# Altium project Power_Mangement.PrjPcb
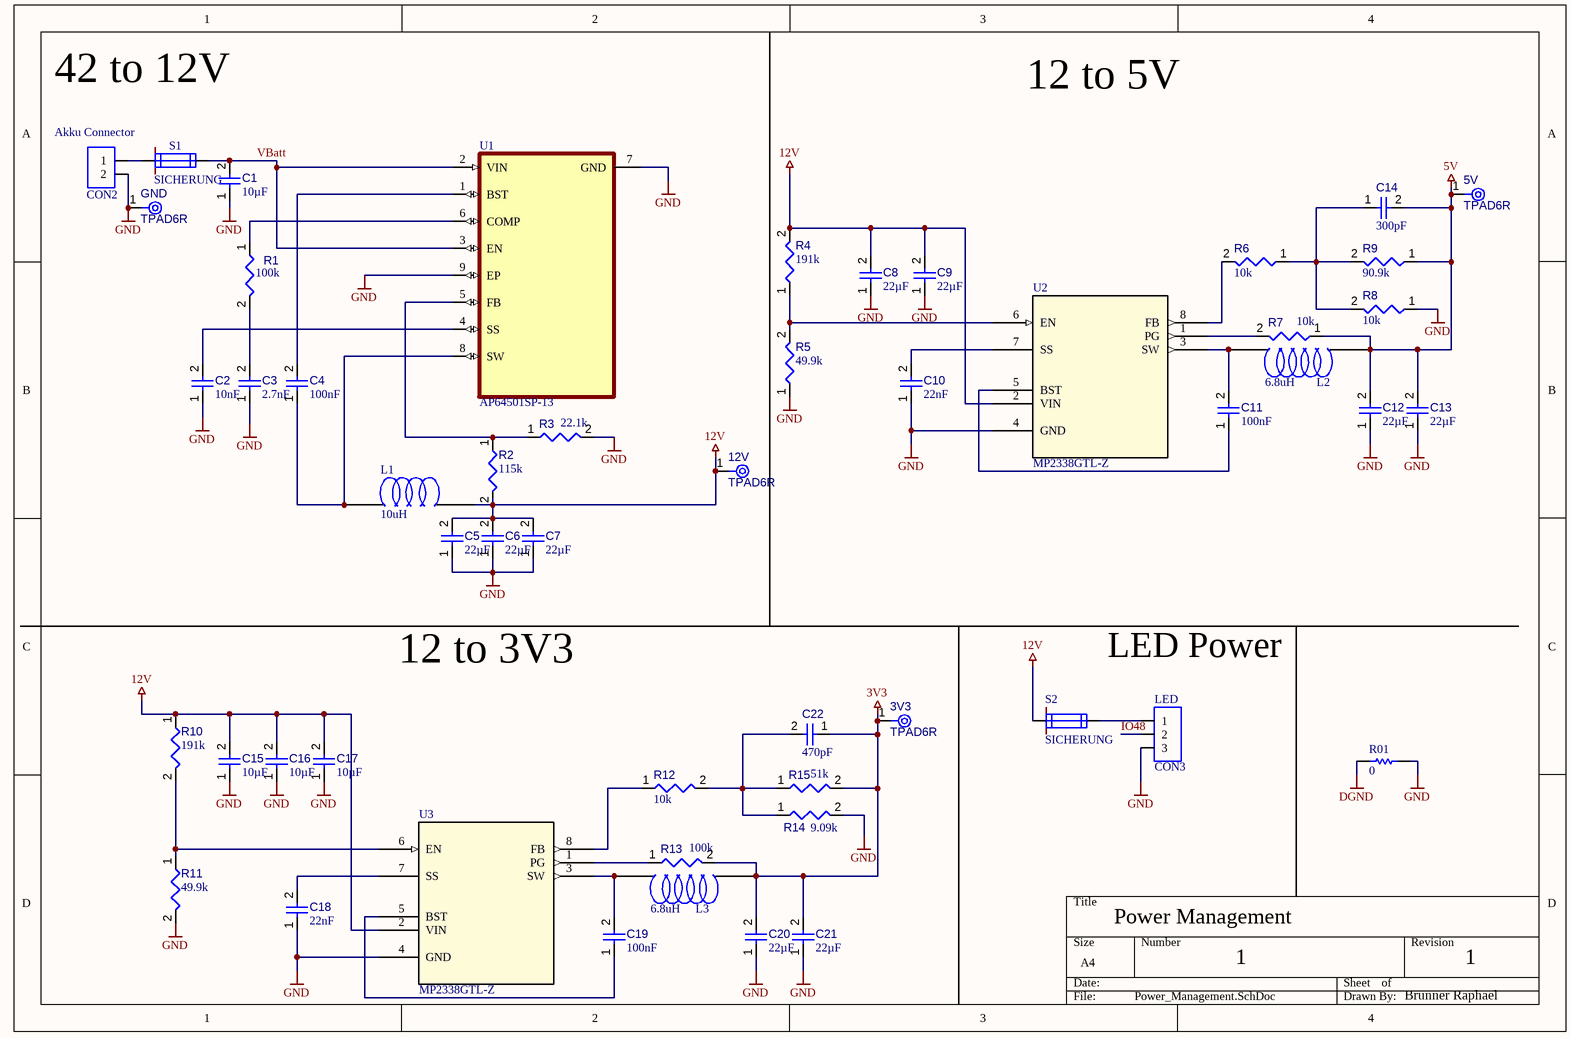
[diagram p0: Power_Management.SchDoc]
4 sheets, 140 parts. Net scope: global (net labels, ports and power ports of the same name join across sheets).
Board file: Power_Managment.PcbDoc
Sheets:
  Power_Management.SchDoc
  Esp32-S3-Mainboard.SchDoc
  Sensors.SchDoc
  Motortreiber.SchDoc

## Sheet Power_Management.SchDoc
size A4; SheetNumber: 1; SheetTotal: 4

### Parts
3V3  TPAD6R  [TP06R]  (no BOM)
5V  TPAD6R  [TP06R]  (no BOM)
12V  TPAD6R  [TP06R]  (no BOM)
Akku_Connector  CON2  [SIP-2]
C1  value 10µF  [CAPC0603(1608)100_L]  (hidden comment: Capacitor 10µF +/-20% 10V 0603)
C2  10nF  [CAPC1608X94X35NL15T15]
C3  2.7nF  [CAPC1608X94X35NL15T15]
C4  value 100nF  [CAPC1608X94X35NL15T15]  (hidden comment: 0.1uF)
C5  value 22µF  [CAPC0805(2012)145_L]  (hidden comment: Capacitor 22µF +/-40% 16V 0805)
C6  value 22µF  [CAPC0805(2012)145_L]  (hidden comment: Capacitor 22µF +/-40% 16V 0805)
C7  value 22µF  [CAPC0805(2012)145_L]  (hidden comment: Capacitor 22µF +/-40% 16V 0805)
C8  value 22µF  [CAPC0805(2012)145_L]  (hidden comment: Capacitor 22µF +/-40% 16V 0805)
C9  value 22µF  [CAPC0805(2012)145_L]  (hidden comment: Capacitor 22µF +/-40% 16V 0805)
C10  value 22nF  [CAPC0402(1005)60_L]  (hidden comment: Capacitor 22nF +/-20% 10V 0402)
C11  value 100nF  [CAPC1608X90X40NL10T20]  (hidden comment: Capacitor 100 nF +/-10% 50 V 0603)
C12  value 22µF  [CAPC0805(2012)145_L]  (hidden comment: Capacitor 22µF +/-40% 16V 0805)
C13  value 22µF  [CAPC0805(2012)145_L]  (hidden comment: Capacitor 22µF +/-40% 16V 0805)
C14  value 300pF  [CAPC1608X90X40NL10T20]  (hidden comment: Capacitor 100 nF +/-10% 50 V 0603)
C15  value 10µF  [CAPC0603(1608)100_L]  (hidden comment: Capacitor 10µF +/-20% 10V 0603)
C16  value 10µF  [CAPC0603(1608)100_L]  (hidden comment: Capacitor 10µF +/-20% 10V 0603)
C17  value 10µF  [CAPC0603(1608)100_L]  (hidden comment: Capacitor 10µF +/-20% 10V 0603)
C18  value 22nF  [CAPC1608X90X40NL10T20]  (hidden comment: Capacitor 100 nF +/-10% 50 V 0603)
C19  value 100nF  [CAPC1608X90X40NL10T20]  (hidden comment: Capacitor 100 nF +/-10% 50 V 0603)
C20  value 22µF  [CAPC0805(2012)145_L]  (hidden comment: Capacitor 22µF +/-40% 16V 0805)
C21  value 22µF  [CAPC0805(2012)145_L]  (hidden comment: Capacitor 22µF +/-40% 16V 0805)
C22  value 470pF  [CAPC1608X90X40NL10T20]  (hidden comment: Capacitor 100 nF +/-10% 50 V 0603)
GND  TPAD6R  [TP06R]  (no BOM)
L1  10uH  [MPL-AY1050]
L2  6.8uH  [MPL-AL6060]
L3  6.8uH  [MPL-AL6060]
LED  CON3  [Sip-3]
R1  value 100k  [RESC1608X55X25ML10T15]  (hidden comment: 34.7k)
R01  value 0  [RESC1608X55X25ML10T15]  (hidden comment: Resistor 0R +/- 5% 0603 100 mW)
R2  115k  [RESC1608X55X25ML10T15]
R3  value 22.1k  [RESC1608X55X25ML10T15]  (hidden comment: 115k)
R4  value 191k  [RESC1608X55X25ML10T15]  (hidden comment: Resistor 100k +/-1% 0603 100 mW)
R5  value 49.9k  [RESC1608X55X25ML10T15]  (hidden comment: Resistor 100k +/-1% 0603 100 mW)
R6  value 10k  [RESC1608X55X25ML10T15]  (hidden comment: Resistor 100k +/-1% 0603 100 mW)
R7  value 10k  [RESC1608X55X25ML10T15]  (hidden comment: Resistor 100k +/-1% 0603 100 mW)
R8  value 10k  [RESC1608X55X25ML10T15]  (hidden comment: Resistor 100k +/-1% 0603 100 mW)
R9  value 90.9k  [RESC1608X55X25ML10T15]  (hidden comment: Resistor 100k +/-1% 0603 100 mW)
R10  value 191k  [RESC1608X55X25ML10T15]  (hidden comment: Resistor 100k +/-1% 0603 100 mW)
R11  value 49.9k  [RESC1608X55X25ML10T15]  (hidden comment: Resistor 100k +/-1% 0603 100 mW)
R12  value 10k  [RESC1608X55X25ML10T15]  (hidden comment: Resistor 100k +/-1% 0603 100 mW)
R13  value 100k  [RESC1608X55X25ML10T15]  (hidden comment: Resistor 100k +/-1% 0603 100 mW)
R14  value 9.09k  [RESC1608X55X25ML10T15]  (hidden comment: Resistor 100k +/-1% 0603 100 mW)
R15  value 51k  [RESC1608X55X25ML10T15]  (hidden comment: Resistor 100k +/-1% 0603 100 mW)
S1  SICHERUNG  [SICHERUNG]
S2  SICHERUNG  [SICHERUNG]
U1  AP64501SP-13  [SOIC127P600X170-9N]
U2  MP2338GTL-Z  [SOT583_MP2338_MNP]
U3  MP2338GTL-Z  [SOT583_MP2338_MNP]

### Nets
3V3: 3V3.1(TP) C20.2 C21.2 C22.1 L3.2 R13.2 R15.2
5V: 5V.1(TP) C12.2 C13.2 C14.2 L2.2 R7.1 R9.1
12V: 12V.1(TP) C5.2 C6.2 C7.2 C8.2 C9.2 C15.2 C16.2 C17.2 L1.2 R2.2 R4.2 R10.1 S2.1 U2.2(VIN) U3.2(VIN)
DGND: R01.1
GND: Akku_Connector.2 C1.1 C2.1 C3.1 C5.1 C6.1 C7.1 C8.1 C9.1 C10.1 C12.1 C13.1 C15.1 C16.1 C17.1 C18.1 C20.1 C21.1 GND.1(TP) LED.3 R01.2 R3.2 R5.1 R8.1 R11.2 R14.2 U1.7(GND) U1.9(EP) U2.4(GND) U3.4(GND)  [project net ALS]
IO48: LED.2
VBatt: C1.2 S1.2 U1.2(VIN) U1.3(EN)
NetAkku_Connector_1: Akku_Connector.1 S1.1
NetC2_2: C2.2 U1.4(SS)
NetC3_2: C3.2 R1.2
NetC4_1: C4.1 L1.1 U1.8(SW)
NetC4_2: C4.2 U1.1(BST)
NetC10_2: C10.2 U2.7(SS)
NetC11_1: C11.1 U2.5(BST)
NetC11_2: C11.2 L2.1 U2.3(SW)
NetC14_1: C14.1 R6.1 R8.2 R9.2
NetC18_2: C18.2 U3.7(SS)
NetC19_1: C19.1 U3.5(BST)
NetC19_2: C19.2 L3.1 U3.3(SW)
NetC22_2: C22.2 R12.2 R14.1 R15.1
NetLED_1: LED.1 S2.2
NetR1_1: R1.1 U1.6(COMP)
NetR2_1: R2.1 R3.1 U1.5(FB)
NetR4_1: R4.1 R5.2 U2.6(EN)
NetR6_2: R6.2 U2.8(FB)
NetR7_2: R7.2 U2.1(PG)
NetR10_2: R10.2 R11.1 U3.6(EN)
NetR12_1: R12.1 U3.8(FB)
NetR13_1: R13.1 U3.1(PG)

### Notes on the sheet
- 42 to 12V
- 12 to 5V
- 12 to 3V3
- LED Power
- Power Management
- 1
- Brunner Raphael

### Library data of the parts
3V3 5V 12V GND = CMP-00028-00002-2: 0.6mm round; Pins: 1
Akku_Connector = CON2: Stecker
C1 C15-C17 = CMP-001-00075-4: Chip Capacitor, 10µF +/-20%, 10V, 0603, Thickness 1 mm; Tolerance: 10%; Voltage Rating: 10V; Max Operating Temperature: 85°C; Pins: 2; Case/Package: 0603; Mounting Technology: SMT; Min Operating Temperature: -55°C
C2-C4 = CMP-001-00003-6: Chip Capacitor, 1 uF, +/- 10%, 16 V, 0603 (1608 Metric); Voltage Rating: 16V; Capacitor Type: Ceramic; Max Operating Temperature: 125°C; Pins: 2; Tolerance: 10%; Min Operating Temperature: -55°C; RoHS Compliant: True; Mounting Technology: SM; Case/Package: 0603
  C2: Value: 10nF
  C3: Value: 2.7nF
C5-C9 C12 C13 C20 C21 = CMP-001-00081-4: Chip Capacitor, 22µF +/-40%, 16V, 0805, Thickness 1.45 mm; Tolerance: 5%; Voltage Rating: 16V; Mounting Technology: SMT; Pins: 2; Max Operating Temperature: 85°C; Case/Package: 0805; Min Operating Temperature: -55°C
C10 = CMP-001-00062-3: Chip Capacitor, 22nF +/-20%, 10V, 0402, Thickness 0.6 mm; Tolerance: 10%; Min Operating Temperature: -55°C; Case/Package: 0402; Pins: 2; Max Operating Temperature: 85°C; Mounting Technology: SMT; Voltage Rating: 10V
C11 C14 C18 C19 C22 = CMP-001-00017-6: Chip Capacitor, 100 nF, +/- 10%, 50 V, 0603 (1608 Metric); Voltage Rating: 50V; Capacitor Type: Ceramic; Tolerance: 10%; Mounting Technology: SM; Max Operating Temperature: 125°C; RoHS Compliant: True; Pins: 2; Case/Package: 0603; Min Operating Temperature: -55°C
L1-L3 = Component_1
LED = CON3: Stecker
R1-R15 = CMP-009-00023-5: Chip Resistor, 100 KOhm, +/- 1%, 0.1 W, -55 to 155 degC, 0603 (1608 Metric); Voltage Rating: 50V; Power: 100mW; Max Operating Temperature: 155°C; RoHS Compliant: True; Tolerance: 1%; Pins: 2; Case/Package: 0603; Mounting Technology: SM; Min Operating Temperature: -55°C
  R2: Value: 115k
R01 = CMP-009-00006-5: Chip Resistor, 0 Ohm, 0.1 W, -55 to 155 degC, 0603 (1608 Metric); Power: 100mW; Voltage Rating: 50V; Max Operating Temperature: 155°C; RoHS Compliant: True; Mounting Technology: SM; Case/Package: 0603; Min Operating Temperature: -55°C; Tolerance: 5%; Pins: 2
S1 S2 = SICHERUNG: Text Field1: Strom
U1 = AP64501SP-13: MF: {'manufacturer': u'Diodes Incorporated'}; Package: None; Price: None; Value: *; MP: AP64501SP-13; Availability: Unavailable
U2 U3 = MP2338GTL-Z: High-Efficiency 28V 3A 450kHz Synchronous Step-Down Converter In SOT583 Package; Manufacturer_Name: Monolithic Power Systems; Copyright: Copyright (C) 2025 Ultra Librarian. All rights reserved.; Manufacturer_Part_Number: MP2338GTL-Z; Datasheet: https://www.monolithicpower.com/en/documentview/productdocument/index/version/2/document_type/Datasheet/lang/en/sku/MP2338GTL; RefDes: RefDes; Type: Type

## Sheet Esp32-S3-Mainboard.SchDoc
size A4; SheetNumber: 2; SheetTotal: 4
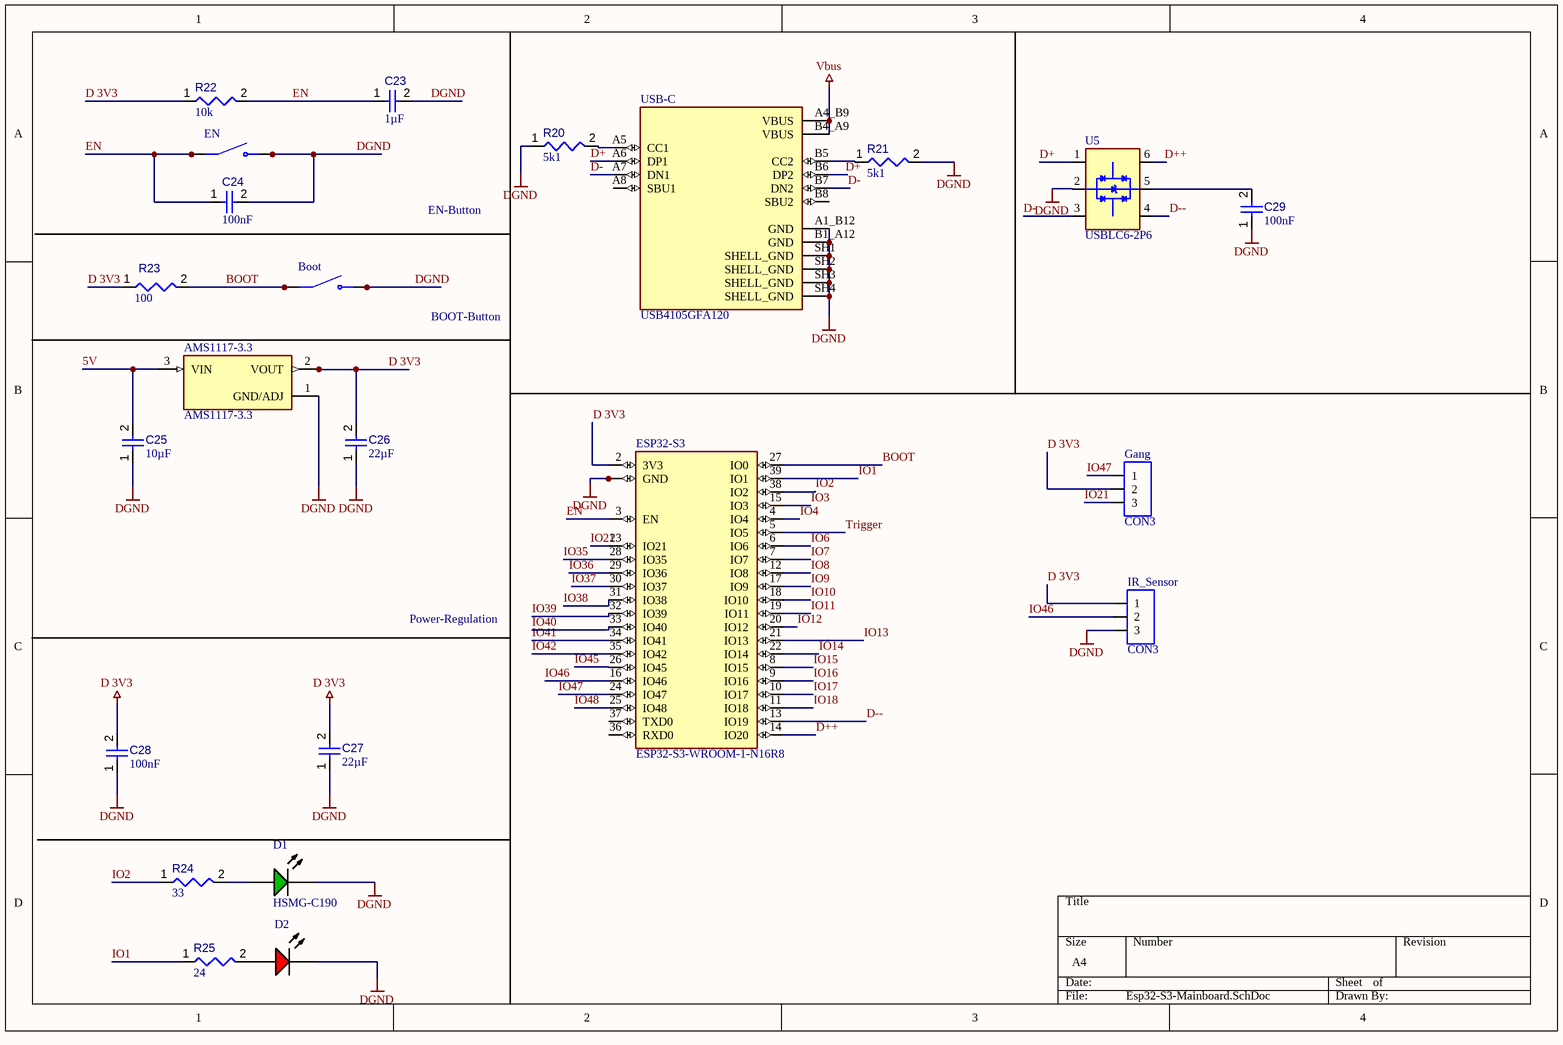
[diagram p1: Esp32-S3-Mainboard.SchDoc]

### Parts
AMS1117-3.3  AMS1117-3.3  [SOT229P700X180-4N]
Boot  FSM2JSMLTR  [SW_1571527-2]  (value not drawn)
C23  value 1µF  [CAPC1608X90X35ML15T15]  (hidden comment: Capacitor 1uF +/- 10% 16V 0603)
C24  value 100nF  [CAPC1608X90X40NL10T20]  (hidden comment: Capacitor 100 nF +/-10% 50 V 0603)
C25  value 10µF  [CAPC0603(1608)100_L]  (hidden comment: Capacitor 10µF +/-20% 10V 0603)
C26  value 22µF  [CAPC0805(2012)145_L]  (hidden comment: Capacitor 22µF +/-40% 16V 0805)
C27  value 22µF  [CAPC0805(2012)145_L]  (hidden comment: Capacitor 22µF +/-40% 16V 0805)
C28  value 100nF  [CAPC1608X90X40NL10T20]  (hidden comment: Capacitor 100 nF +/-10% 50 V 0603)
C29  value 100nF  [CAPC0402(1005)60_L]  (hidden comment: Capacitor 100nF +/-20% 50V 0402)
D1  HSMG-C190  [AVAG-HSMX-C190_V]
D2  19-217/R6C-AL1M2VY/3T  [EVRL-0603-2_V]  (value not drawn)
EN  FSM2JSMLTR  [SW_1571527-2]  (value not drawn)
ESP32-S3  ESP32-S3-WROOM-1-N16R8  [ESP32S3WROOM1N8R2]
Gang  CON3  [Sip-3]
IR_Sensor  CON3  [Sip-3]
R20  value 5k1  [RESC1608X55X25ML10T15]  (hidden comment: Resistor 100k +/-1% 0603 100 mW)
R21  value 5k1  [RESC1608X55X25ML10T15]  (hidden comment: Resistor 100k +/-1% 0603 100 mW)
R22  value 10k  [RESC1608X55X25ML10T15]  (hidden comment: Resistor 10k +/-1% 0603 100 mW)
R23  value 100  [RESC1608X55X25ML10T15]  (hidden comment: Resistor 10k +/-1% 0603 100 mW)
R24  value 33  [RESC1608X55X25ML10T15]  (hidden comment: Resistor 10k +/-1% 0603 100 mW)
R25  value 24  [RESC1608X55X25ML10T15]  (hidden comment: Resistor 10k +/-1% 0603 100 mW)
U5  USBLC6-2P6  [SOT50P160X60-6N]
USB-C  USB4105GFA120  [GCT_USB4105GFA120]

### Nets
5V: AMS1117-3.3.3(VIN) C25.2
D 3V3: AMS1117-3.3.2(VOUT) C26.2 C27.2 C28.2 ESP32-S3.2(3V3) Gang.2 IR_Sensor.1 R22.1 R23.1
DGND: AMS1117-3.3.1(GND/ADJ) Boot.3(NO) Boot.4(NO) C23.2 C24.2 C25.1 C26.1 C27.1 C28.1 C29.1 D1.2(K) D2.2(K) EN.3(NO) EN.4(NO) ESP32-S3.1(GND) ESP32-S3.40(GND) ESP32-S3.41(GND) ESP32-S3.42(GND) ESP32-S3.43(GND) ESP32-S3.44(GND) ESP32-S3.45(GND) ESP32-S3.46(GND) ESP32-S3.47(GND) ESP32-S3.48(GND) ESP32-S3.49(GND) IR_Sensor.3 R20.1 R21.2 U5.2(GND) USB-C.A1_B12(GND) USB-C.B1_A12(GND) USB-C.SH1(SHELL_GND) USB-C.SH2(SHELL_GND) USB-C.SH3(SHELL_GND) USB-C.SH4(SHELL_GND)
Vbus: USB-C.A4_B9(VBUS) USB-C.B4_A9(VBUS)
BOOT: Boot.1(COM) Boot.2(COM) ESP32-S3.27(IO0) R23.2
D+: U5.1(I/O1_1) USB-C.A6(DP1) USB-C.B6(DP2)
D++: ESP32-S3.14(IO20) U5.6(I/O1_2)
D-: U5.3(I/O2_1) USB-C.A7(DN1) USB-C.B7(DN2)
D--: ESP32-S3.13(IO19) U5.4(I/O2_2)
EN: C23.1 C24.1 EN.1(COM) EN.2(COM) ESP32-S3.3(EN) R22.2
IO1: ESP32-S3.39(IO1) R25.1
IO2: ESP32-S3.38(IO2) R24.1
IO3: ESP32-S3.15(IO3)
IO4: ESP32-S3.4(IO4)
IO6: ESP32-S3.6(IO6)
IO7: ESP32-S3.7(IO7)
IO8: ESP32-S3.12(IO8)
IO9: ESP32-S3.17(IO9)
IO10: ESP32-S3.18(IO10)
IO11: ESP32-S3.19(IO11)
IO12: ESP32-S3.20(IO12)
IO13: ESP32-S3.21(IO13)
IO14: ESP32-S3.22(IO14)
IO15: ESP32-S3.8(IO15)
IO16: ESP32-S3.9(IO16)
IO17: ESP32-S3.10(IO17)
IO18: ESP32-S3.11(IO18)
IO21: ESP32-S3.23(IO21) Gang.3
IO35: ESP32-S3.28(IO35)
IO36: ESP32-S3.29(IO36)
IO37: ESP32-S3.30(IO37)
IO38: ESP32-S3.31(IO38)
IO39: ESP32-S3.32(IO39)
IO40: ESP32-S3.33(IO40)
IO41: ESP32-S3.34(IO41)
IO42: ESP32-S3.35(IO42)
IO45: ESP32-S3.26(IO45)
IO46: ESP32-S3.16(IO46) IR_Sensor.2
IO47: ESP32-S3.24(IO47) Gang.1
IO48: ESP32-S3.25(IO48)
Trigger: ESP32-S3.5(IO5)
NetC29_2: C29.2 U5.5(VBUS)
NetD1_1: D1.1(A) R24.2
NetD2_1: D2.1(A) R25.2
NetR20_2: R20.2 USB-C.A5(CC1)
NetR21_1: R21.1 USB-C.B5(CC2)

Not connected (* = marked no-connect by the designer): ESP32-S3 36(RXD0) 37(TXD0); USB-C A8(SBU1) B8(SBU2)

### Notes on the sheet
- EN-Button
- BOOT-Button
- Power-Regulation

### Library data of the parts
AMS1117-3.3 = AMS1117-3.3: LDO Voltage Regulators 800MA LDO LINEAR REG; MF: ams AG; SnapEDA_Link: https://www.snapeda.com/parts/AMS1117-3.3/ams/view-part/?ref=snap; Package: SOT-223 Seeed Technology; Value: *; MP: AMS1117-3.3; Check_prices: https://www.snapeda.com/parts/AMS1117-3.3/ams/view-part/?ref=eda
Boot EN = CMP-016-000000-1: Switch Tactile OFF (ON) SPST Round Button Gull Wing 0.05A 24VDC 0.98N SMD T/R; MF: TE Connectivity; SnapEDA_Link: https://www.snapeda.com/parts/FSM2JSMLTR/TE+Connectivity+ALCOSWITCH+Switches/view-part/?ref=snap; Package: None; Check_prices: https://www.snapeda.com/parts/FSM2JSMLTR/TE+Connectivity+ALCOSWITCH+Switches/view-part/?ref=eda; Design Item ID: FSM2JSMLTR; Source: FSM2JSMLTR.SchLib; Value: *; MP: FSM2JSMLTR
C23 = CMP-001-00004-6: Chip Capacitor, 1 uF, +/- 10%, 16 V, 0603 (1608 Metric); Capacitor Type: Ceramic; Mounting Technology: SM; RoHS Compliant: True; Min Operating Temperature: -55°C; Case/Package: 0603; Pins: 2; Voltage Rating: 16V; Max Operating Temperature: 125°C; Tolerance: 10%
C24 C28 = CMP-001-00017-6: as C11 on sheet Power_Management; Tolerance: 10%; Mounting Technology: SM; Max Operating Temperature: 125°C; RoHS Compliant: True; Pins: 2; Case/Package: 0603; Min Operating Temperature: -55°C
C25 = CMP-001-00075-4: as C1 on sheet Power_Management; Voltage Rating: 10V; Max Operating Temperature: 85°C; Pins: 2; Case/Package: 0603; Mounting Technology: SMT; Min Operating Temperature: -55°C
C26 C27 = CMP-001-00081-4: as C5 on sheet Power_Management; Voltage Rating: 16V; Mounting Technology: SMT; Pins: 2; Max Operating Temperature: 85°C; Case/Package: 0805; Min Operating Temperature: -55°C
C29 = CMP-001-00067-3: Chip Capacitor, 100nF +/-20%, 50V, 0402, Thickness 0.6 mm; Tolerance: 10%; Min Operating Temperature: -55°C; Pins: 2; Case/Package: 0402; Max Operating Temperature: 85°C; Voltage Rating: 50V; Mounting Technology: SMT
D1 = CMP-007-00013-2: LED Uni-Color Green, 52 mW, 20 mA, -40 to 85 degC, 2-Pin SMD, RoHS, Tape and Reel; Manufacturer: Avago; Forward Current: 20mA; Viewing Angle: 170degrees; Luminous Intensity: 15mcd; Lens Style: Diffused; Forward Voltage: 2.2V; Power: 52mW; Mounting Technology: SM; RoHS Compliant: True; Packaging: TapeandReel; Illumination Colour: Green; Datasheet URL: http://docs.avagotech.com/docs/AV02-0551EN; Min Operating Temperature: -40°C; Max Operating Temperature: 85°C; Pins: 2; Package Description: 2-Pin Surface Mount Device, Body 1.6 x 0.8 mm, Height 0.9 mm; Nominal Vf: 2.2V; Case/Package: 0603; Manufacturer URL: http://www.avagotech.com/; Datasheet Version: Mar-12; Colour: Green; Package Reference: HSMX-C190; Package Quantity: 4000
D2 = CMP-007-00004-2: Chip LED, Red, 5 V, 25 mA, -40 to 85 degC, 2-Pin SMD (0603), RoHS, Tape and Reel; Manufacturer: Everlight Electronics; Forward Voltage: 2.2V; Lens Style: Clear; Package Reference: 0603; Datasheet Version: Rev. 1, 01/2005; Mounting Technology: SM; RoHS Compliant: False; Datasheet URL: https://datasheet.ciiva.com/4688/el-19-217-r6c-al1m2vy-3tpdf-187026-4688713.pdf; Case/Package: 0603; Colour: Red; Manufacturer URL: http://www.everlight.com/; Package Description: 2-Pin Surface Mount Device, Body 1.6 x 0.8 mm
ESP32-S3 = ESP32-S3-WROOM-1-N16R8: Bluetooth, WiFi 802.11b/g/n, Bluetooth v5.0 Transceiver Module 2.4GHz PCB Trace Surface Mount; MF: Espressif Systems; SnapEDA_Link: https://www.snapeda.com/parts/ESP32-S3-WROOM-1-N16R8/Espressif+Systems/view-part/?ref=snap; Package: NON STANDARD Espressif Systems; Value: *; MP: ESP32-S3-WROOM-1-N16R8; Check_prices: https://www.snapeda.com/parts/ESP32-S3-WROOM-1-N16R8/Espressif+Systems/view-part/?ref=eda
Gang IR_Sensor = CON3: Stecker
R20 R21 = CMP-009-00023-5: as R1 on sheet Power_Management; Max Operating Temperature: 155°C; RoHS Compliant: True; Tolerance: 1%; Pins: 2; Case/Package: 0603; Mounting Technology: SM; Min Operating Temperature: -55°C
R22-R25 = CMP-009-00017-5: Chip Resistor, 10 KOhm, +/- 1%, 01 W, -55 to 155 degC, 0603 (1608 Metric); Voltage Rating: 50V; Power: 100mW; RoHS Compliant: True; Min Operating Temperature: -55°C; Pins: 2; Case/Package: 0603; Mounting Technology: SM; Max Operating Temperature: 155°C; Tolerance: 1%
U5 = USBLC6-2P6: 17V Clamp 5A (8/20Âµs) Ipp Tvs Diode Surface Mount SOT-666; MF: STMicroelectronics; SnapEDA_Link: https://www.snapeda.com/parts/USBLC6-2P6/STMicroelectronics/view-part/?ref=snap; Package: SOT-666 STMicroelectronics; Value: *; MP: USBLC6-2P6; Check_prices: https://www.snapeda.com/parts/USBLC6-2P6/STMicroelectronics/view-part/?ref=eda
USB-C = USB4105GFA120: USB CONN, 2.0 TYPE C, RCPT, 16POS, SMT; USB Connector Type:USB Type C; USB Standard:USB 2.0; Gender:Receptacle; No. of Positions:16Positions; Connector Mounting:Surface Mount, Through Hole Mount; Orientation:Right Angle RoHS Compliant: Yes; MF: Global Connector Technology; SnapEDA_Link: https://www.snapeda.com/parts/USB4105GFA120/Global+Connector+Technology/view-part/?ref=snap; Package: None; Value: *; MP: USB4105GFA120; Check_prices: https://www.snapeda.com/parts/USB4105GFA120/Global+Connector+Technology/view-part/?ref=eda

## Sheet Sensors.SchDoc
size A4; SheetNumber: 3; SheetTotal: 4
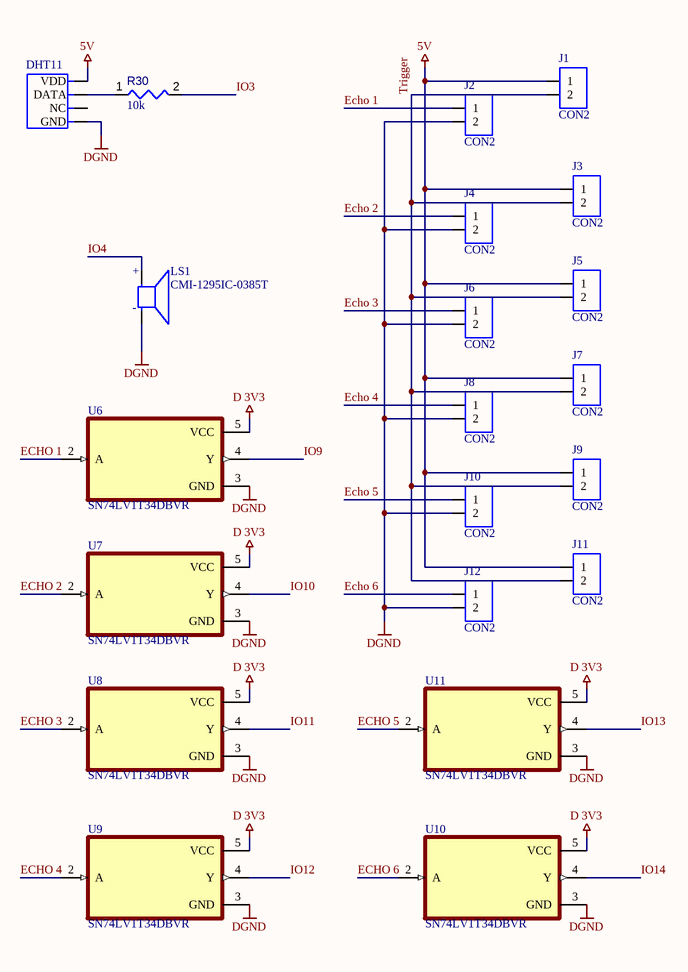
[diagram p2: Sensors.SchDoc]

### Parts
(Parts that share a designator on the sheet are numbered #1, #2 ... from top to bottom, then left to right.)
DHT11  TEM-HUM-DHT11(4P-15.5X12.0MM)  [SNR4-2.54-15.5X12.0X5.5MM]  (value not drawn)
J1  CON2  [SIP-2]
J2  CON2  [SIP-2]
J3  CON2  [SIP-2]
J4  CON2  [SIP-2]
J5  CON2  [SIP-2]
J6  CON2  [SIP-2]
J7  CON2  [SIP-2]
J8  CON2  [SIP-2]
J9  CON2  [SIP-2]
J10  CON2  [SIP-2]
J11  CON2  [SIP-2]
J12  CON2  [SIP-2]
LS1  CMI-1295IC-0385T  [CUI_CMI-1295IC-0385T]
R30  value 10k  [RESC1608X55X25ML10T15]  (hidden comment: Resistor 10k +/-1% 0603 100 mW)
U6#1  SN74LV1T34DBVR  [SOT95P280X145-5N]
U7#1  SN74LV1T34DBVR  [SOT95P280X145-5N]
U8  SN74LV1T34DBVR  [SOT95P280X145-5N]
U9  SN74LV1T34DBVR  [SOT95P280X145-5N]
U10  SN74LV1T34DBVR  [SOT95P280X145-5N]
U11  SN74LV1T34DBVR  [SOT95P280X145-5N]

### Nets
5V: DHT11.1(VDD) J1.1 J3.1 J5.1 J7.1 J9.1 J11.1
D 3V3: U6#1.5(VCC) U7#1.5(VCC) U8.5(VCC) U9.5(VCC) U10.5(VCC) U11.5(VCC)
DGND: DHT11.4(GND) J2.2 J4.2 J6.2 J8.2 J10.2 J12.2 LS1.N U6#1.3(GND) U7#1.3(GND) U8.3(GND) U9.3(GND) U10.3(GND) U11.3(GND)
Echo 1: J2.1 U6#1.2(A)
Echo 2: J4.1 U7#1.2(A)
Echo 3: J6.1 U8.2(A)
Echo 4: J8.1 U9.2(A)
Echo 5: J10.1 U11.2(A)
Echo 6: J12.1 U10.2(A)
IO3: R30.2
IO4: LS1.P
IO9: U6#1.4(Y)
IO10: U7#1.4(Y)
IO11: U8.4(Y)
IO12: U9.4(Y)
IO13: U11.4(Y)
IO14: U10.4(Y)
Trigger: J1.2 J3.2 J5.2 J7.2 J9.2 J11.2
NetDHT11_2: DHT11.2(DATA) R30.1

Not connected (* = marked no-connect by the designer): DHT11 3(NC)

### Notes on the sheet
- (in symbol CMI-1295IC-0385T) +; -

### Library data of the parts
DHT11 = TEM-HUM-DHT11(4P-15.5X12.0MM): Äá»™ áº©m, nhiá»‡t Ä‘á»™ Ká»¹ thuáº­t sá»‘ Â±5% RH qua lá»—; MF: UNIVERSAL-SOLDER Electronics Ltd; MP: DHT11; SnapEDA_Link: https://www.snapeda.com/parts/DHT11/UNIVERSAL-SOLDER+Electronics+Ltd/view-part/?ref=snap; Package: None; Value: *; Check_prices: https://www.snapeda.com/parts/DHT11/UNIVERSAL-SOLDER+Electronics+Ltd/view-part/?ref=eda
J1-J12 = CON2: Stecker
LS1 = CMI-1295IC-0385T: 12 mm, 3 Vdc, 85 dB, Through Hole, Driving Circuit, Magnetic Audio Indicator Buzzer; MF: Same Sky; SnapEDA_Link: https://www.snapeda.com/parts/CMI-1295IC-0385T/Same+Sky/view-part/?ref=snap; Package: Package; Value: *; MP: CMI-1295IC-0385T; Check_prices: https://www.snapeda.com/parts/CMI-1295IC-0385T/Same+Sky/view-part/?ref=eda
R30 = CMP-009-00017-5: as R22 on sheet Esp32-S3-Mainboard; RoHS Compliant: True; Min Operating Temperature: -55°C; Pins: 2; Case/Package: 0603; Mounting Technology: SM; Max Operating Temperature: 155°C; Tolerance: 1%
U6#1 U7#1 U8-U11 = SN74LV1T34DBVR: Single Power Supply BUFFER Logic Level Shifter (no enable); MF: Texas Instruments; SnapEDA_Link: https://www.snapeda.com/parts/SN74LV1T34DBVR/Texas+Instruments/view-part/?ref=snap; Package: SOT-23-5 Texas Instruments; Value: *; MP: SN74LV1T34DBVR; Check_prices: https://www.snapeda.com/parts/SN74LV1T34DBVR/Texas+Instruments/view-part/?ref=eda

## Sheet Motortreiber.SchDoc
size A4; SheetNumber: 4; SheetTotal: 4
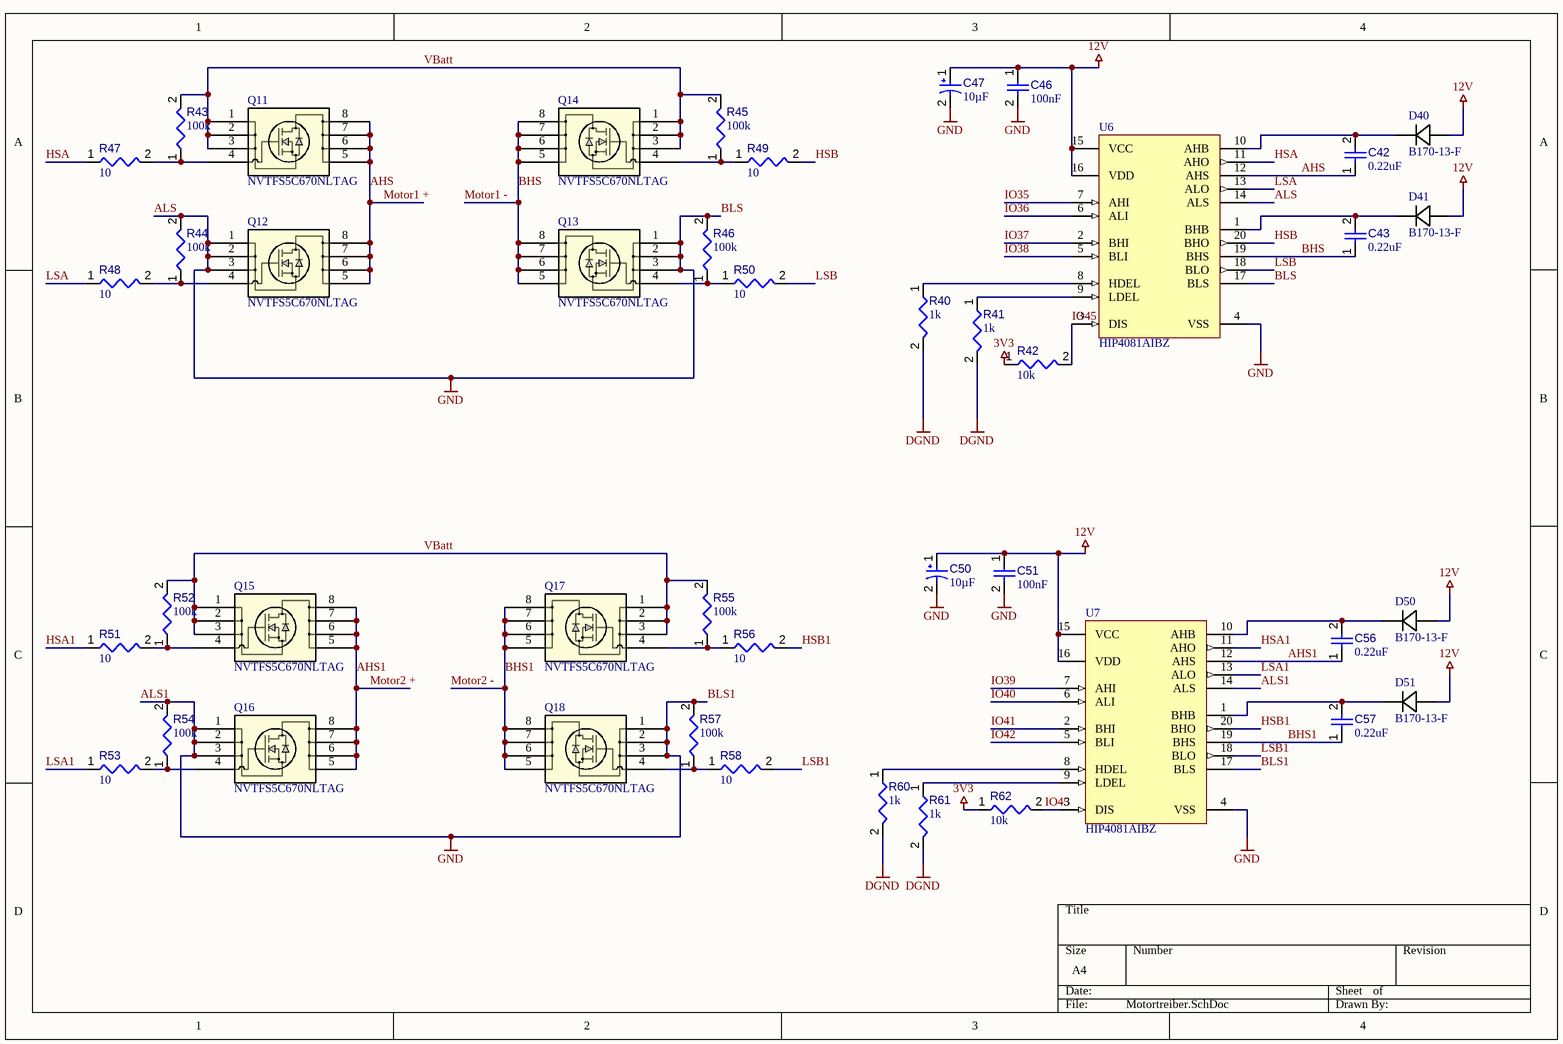
[diagram p3: Motortreiber.SchDoc]

### Parts
(Parts that share a designator on the sheet are numbered #1, #2 ... from top to bottom, then left to right.)
C42  value 0.22uF  [CAPC1608X90X40NL10T20]  (hidden comment: Capacitor 100 nF +/-10% 50 V 0603)
C43  value 0.22uF  [CAPC1608X90X40NL10T20]  (hidden comment: Capacitor 100 nF +/-10% 50 V 0603)
C46  value 100nF  [CAPC1608X90X40NL10T20]  (hidden comment: Capacitor 100 nF +/-10% 50 V 0603)
C47  value 10µF  [CAPPR55-200-1100X500X1200]  (hidden comment: ECA1HM100)
C50  value 10µF  [CAPPR55-200-1100X500X1200]  (hidden comment: ECA1HM100)
C51  value 100nF  [CAPC1608X90X40NL10T20]  (hidden comment: Capacitor 100 nF +/-10% 50 V 0603)
C56  value 0.22uF  [CAPC1608X90X40NL10T20]  (hidden comment: Capacitor 100 nF +/-10% 50 V 0603)
C57  value 0.22uF  [CAPC1608X90X40NL10T20]  (hidden comment: Capacitor 100 nF +/-10% 50 V 0603)
D40  B170-13-F  [SMA_DIO]
D41  B170-13-F  [SMA_DIO]
D50  B170-13-F  [SMA_DIO]
D51  B170-13-F  [SMA_DIO]
Q11  NVTFS5C670NLTAG  [WDFN8_511AB_ONS]
Q12  NVTFS5C670NLTAG  [WDFN8_511AB_ONS]
Q13  NVTFS5C670NLTAG  [WDFN8_511AB_ONS]
Q14  NVTFS5C670NLTAG  [WDFN8_511AB_ONS]
Q15  NVTFS5C670NLTAG  [WDFN8_511AB_ONS]
Q16  NVTFS5C670NLTAG  [WDFN8_511AB_ONS]
Q17  NVTFS5C670NLTAG  [WDFN8_511AB_ONS]
Q18  NVTFS5C670NLTAG  [WDFN8_511AB_ONS]
R40  value 1k  [RESC1608X55X25ML10T15]  (hidden comment: Resistor 1k +/-1% 0603 100 mW)
R41  value 1k  [RESC1608X55X25ML10T15]  (hidden comment: Resistor 1k +/-1% 0603 100 mW)
R42  value 10k  [RESC1608X55X25ML10T15]  (hidden comment: Resistor 10k +/-1% 0603 100 mW)
R43  value 100k  [RESC1608X55X25ML10T15]  (hidden comment: Resistor 100k +/-1% 0603 100 mW)
R44  value 100k  [RESC1608X55X25ML10T15]  (hidden comment: Resistor 100k +/-1% 0603 100 mW)
R45  value 100k  [RESC1608X55X25ML10T15]  (hidden comment: Resistor 100k +/-1% 0603 100 mW)
R46  value 100k  [RESC1608X55X25ML10T15]  (hidden comment: Resistor 100k +/-1% 0603 100 mW)
R47  value 10  [RESC1608X55X25ML10T15]  (hidden comment: Resistor 100k +/-1% 0603 100 mW)
R48  value 10  [RESC1608X55X25ML10T15]  (hidden comment: Resistor 100k +/-1% 0603 100 mW)
R49  value 10  [RESC1608X55X25ML10T15]  (hidden comment: Resistor 100k +/-1% 0603 100 mW)
R50  value 10  [RESC1608X55X25ML10T15]  (hidden comment: Resistor 100k +/-1% 0603 100 mW)
R51  value 10  [RESC1608X55X25ML10T15]  (hidden comment: Resistor 100k +/-1% 0603 100 mW)
R52  value 100k  [RESC1608X55X25ML10T15]  (hidden comment: Resistor 100k +/-1% 0603 100 mW)
R53  value 10  [RESC1608X55X25ML10T15]  (hidden comment: Resistor 100k +/-1% 0603 100 mW)
R54  value 100k  [RESC1608X55X25ML10T15]  (hidden comment: Resistor 100k +/-1% 0603 100 mW)
R55  value 100k  [RESC1608X55X25ML10T15]  (hidden comment: Resistor 100k +/-1% 0603 100 mW)
R56  value 10  [RESC1608X55X25ML10T15]  (hidden comment: Resistor 100k +/-1% 0603 100 mW)
R57  value 100k  [RESC1608X55X25ML10T15]  (hidden comment: Resistor 100k +/-1% 0603 100 mW)
R58  value 10  [RESC1608X55X25ML10T15]  (hidden comment: Resistor 100k +/-1% 0603 100 mW)
R60  value 1k  [RESC1608X55X25ML10T15]  (hidden comment: Resistor 1k +/-1% 0603 100 mW)
R61  value 1k  [RESC1608X55X25ML10T15]  (hidden comment: Resistor 1k +/-1% 0603 100 mW)
R62  value 10k  [RESC1608X55X25ML10T15]  (hidden comment: Resistor 10k +/-1% 0603 100 mW)
U6#2  HIP4081AIBZ  [M20_3_MFG]
U7#2  HIP4081AIBZ  [M20_3_MFG]

### Nets
3V3: R42.1 R62.1
12V: C46.1 C47.1 C50.1 C51.1 D40.2 D41.2 D50.2 D51.2 U6#2.15(VCC) U6#2.16(VDD) U7#2.15(VCC) U7#2.16(VDD)
ALS: C46.2 C47.2 C50.2 C51.2 Q12.1 Q12.2 Q12.3 Q13.1 Q13.2 Q13.3 Q16.1 Q16.2 Q16.3 Q18.1 Q18.2 Q18.3 R44.2 R46.2 R54.2 R57.2 U6#2.4(VSS) U6#2.14(ALS) U6#2.17(BLS) U7#2.4(VSS) U7#2.14(ALS) U7#2.17(BLS)  [also labelled ALS1, BLS, BLS1, GND]
DGND: R40.2 R41.2 R60.2 R61.2
AHS: C42.1 Q11.5 Q11.6 Q11.7 Q11.8 Q12.5 Q12.6 Q12.7 Q12.8 U6#2.12(AHS)  [also labelled Motor1 +]
AHS1: C56.1 Q15.5 Q15.6 Q15.7 Q15.8 Q16.5 Q16.6 Q16.7 Q16.8 U7#2.12(AHS)  [also labelled Motor2 +]
BHS: C43.1 Q13.5 Q13.6 Q13.7 Q13.8 Q14.5 Q14.6 Q14.7 Q14.8 U6#2.19(BHS)  [also labelled Motor1 -]
BHS1: C57.1 Q17.5 Q17.6 Q17.7 Q17.8 Q18.5 Q18.6 Q18.7 Q18.8 U7#2.19(BHS)  [also labelled Motor2 -]
HSA: R47.1 U6#2.11(AHO)
HSA1: R51.1 U7#2.11(AHO)
HSB: R49.2 U6#2.20(BHO)
HSB1: R56.2 U7#2.20(BHO)
IO35: U6#2.7(AHI)
IO36: U6#2.6(ALI)
IO37: U6#2.2(BHI)
IO38: U6#2.5(BLI)
IO39: U7#2.7(AHI)
IO40: U7#2.6(ALI)
IO41: U7#2.2(BHI)
IO42: U7#2.5(BLI)
IO45: R42.2 R62.2 U6#2.3(DIS) U7#2.3(DIS)
LSA: R48.1 U6#2.13(ALO)
LSA1: R53.1 U7#2.13(ALO)
LSB: R50.2 U6#2.18(BLO)
LSB1: R58.2 U7#2.18(BLO)
VBatt: Q11.1 Q11.2 Q11.3 Q14.1 Q14.2 Q14.3 Q15.1 Q15.2 Q15.3 Q17.1 Q17.2 Q17.3 R43.2 R45.2 R52.2 R55.2
NetC42_2: C42.2 D40.1 U6#2.10(AHB)
NetC43_2: C43.2 D41.1 U6#2.1(BHB)
NetC56_2: C56.2 D50.1 U7#2.10(AHB)
NetC57_2: C57.2 D51.1 U7#2.1(BHB)
NetQ11_4: Q11.4 R43.1 R47.2
NetQ12_4: Q12.4 R44.1 R48.2
NetQ13_4: Q13.4 R46.1 R50.1
NetQ14_4: Q14.4 R45.1 R49.1
NetQ15_4: Q15.4 R51.2 R52.1
NetQ16_4: Q16.4 R53.2 R54.1
NetQ17_4: Q17.4 R55.1 R56.1
NetQ18_4: Q18.4 R57.1 R58.1
NetR40_1: R40.1 U6#2.8(HDEL)
NetR41_1: R41.1 U6#2.9(LDEL)
NetR60_1: R60.1 U7#2.8(HDEL)
NetR61_1: R61.1 U7#2.9(LDEL)

### Library data of the parts
C42 C43 C46 C51 C56 C57 = CMP-001-00017-6: as C11 on sheet Power_Management; Tolerance: 10%; Mounting Technology: SM; Max Operating Temperature: 125°C; RoHS Compliant: True; Pins: 2; Case/Package: 0603; Min Operating Temperature: -55°C
C47 C50 = CMP-001-00025-7: Aluminum Electrolytic Capacitor, 10 uF, +/- 20%, 50 V, -40 to 85 degC, 2-Pin THD, RoHS, Bulk; Manufacturer: Panasonic; Ripple Current (AC): 65mA; Voltage Rating: 50V; Mounting Technology: TH; RoHS Compliant: True; Capacitor Type: Electrolytic; Datasheet Version: Rev. 05, 10/2016; Min Operating Temperature: -40°C; Packaging: Bulk; Ripple Current: 65mA; Tolerance: 20%; Max Operating Temperature: 85°C; Datasheet URL: https://industrial.panasonic.com/cdbs/www-data/pdf/RDF0000/ABA0000C1218.pdf; Lead Pitch: 2mm; Pins: 2; Diameter: 5mm; Manufacturer URL: http://www.panasonic.com/; Package Reference: CAPPR55-200-1100X500X1200; Package Description: 2-Pin Radial Lead, Dia 5 mm, Height 12 mm; Case/Package: Radial; Package Quantity: 200
D40 D41 D50 D51 = B170-13-F: No Description Available; Manufacturer_Name: Diodes Inc; Copyright: Copyright (C) 2025 Ultra Librarian. All rights reserved.; Manufacturer_Part_Number: B170-13-F
Q11-Q18 = NVTFS5C670NLTAG: No Description Available; Manufacturer_Name: onsemi; Copyright: Copyright (C) 2025 Ultra Librarian. All rights reserved.; Manufacturer_Part_Number: NVTFS5C670NLTAG; RefDes: RefDes; Type: Type
R40 R41 R60 R61 = CMP-009-00014-5: Chip Resistor, 1 KOhm, +/-1%, 0.1 W, -55 to 155 degC, 0603 (1608 Metric); Voltage Rating: 50V; Power: 100mW; Tolerance: 1%; Mounting Technology: SM; Pins: 2; Case/Package: 0603; Min Operating Temperature: -55°C; RoHS Compliant: True; Max Operating Temperature: 155°C
R42 R62 = CMP-009-00017-5: as R22 on sheet Esp32-S3-Mainboard; RoHS Compliant: True; Min Operating Temperature: -55°C; Pins: 2; Case/Package: 0603; Mounting Technology: SM; Max Operating Temperature: 155°C; Tolerance: 1%
R43-R58 = CMP-009-00023-5: as R1 on sheet Power_Management; Max Operating Temperature: 155°C; RoHS Compliant: True; Tolerance: 1%; Pins: 2; Case/Package: 0603; Mounting Technology: SM; Min Operating Temperature: -55°C
U6#2 U7#2 = CMP-00572-88252432-3: Driver 2.5A 4-OUT Hi/Lo Side Full Brdg/Half Brdg Inv/Non-Inv Automotive 20-Pin SOIC W Tube; Manufacturer Lifecycle Status: ACTIVE; Fall Time: 10ns; Switching Frequency: 1MHz; Overload Protection: Under Voltage; Power Dissipation: 440mW; Number of Drivers: 4; Min Supply Voltage: 9.5V; Max Supply Voltage: 15V; Pitch: 1.3mm; Propagation Delay: 30ns; RAM Size: 32kB; Max Supply Current: 15.5mA; Output Voltage: 80V; Max Junction Temperature (Tj): 125°C; Rise Time: 10ns; ComponentLink1Description: Manufacturer's Website; ComponentLink2URL: https://octopart.com/cad-content/api/get-model-datasheet/15189/88252432; Max Power Dissipation: 440mW; REACH SVHC: No; Number of Outputs: 4; ComponentLink3URL: https://www.renesas.com/en/document/psc/package-drawing-soicw-20pin-m203?r=571616; Lifecycle Status: Production; Min Operating Temperature: -40°C; Export Control Classification Number (ECCN) Code: EAR99; Height: 0m; Max Output Current: 2.5A; Case/Package: SOIC; ComponentLink3Description: Manufacturer's Package Drawing; HelpURL: https://octopart.com/cad-content/api/get-model-datasheet/15189/88252432; ComponentLink1URL: http://www.renesas.com; ComponentLink2Description: Datasheet URL; Output Current: 2.5A; Packaging: Bulk; Width: 7.5mm; Number of Pins: 20; RoHS: Compliant; Mount: Surface Mount; Length: 12.9mm; Ambient Temperature Range High: 85°C; Max Operating Temperature: 85°C; Lead Free: Lead Free; Number of Channels: 4

## Nets that join several sheets
3V3: Power_Management (7 pins), Motortreiber (R42.1 R62.1)
5V: Power_Management (7 pins), Esp32-S3-Mainboard (AMS1117-3.3.3 C25.2), Sensors (7 pins)
12V: Power_Management (16 pins), Motortreiber (12 pins)
ALS: Power_Management (30 pins), Motortreiber (26 pins)
D 3V3: Esp32-S3-Mainboard (9 pins), Sensors (6 pins)
DGND: Power_Management (R01.1), Esp32-S3-Mainboard (35 pins), Sensors (14 pins), Motortreiber (R40.2 R41.2 R60.2 R61.2)
IO3: Esp32-S3-Mainboard (ESP32-S3.15), Sensors (R30.2)
IO4: Esp32-S3-Mainboard (ESP32-S3.4), Sensors (LS1.P)
IO9: Esp32-S3-Mainboard (ESP32-S3.17), Sensors (U6#1.4)
IO10: Esp32-S3-Mainboard (ESP32-S3.18), Sensors (U7#1.4)
IO11: Esp32-S3-Mainboard (ESP32-S3.19), Sensors (U8.4)
IO12: Esp32-S3-Mainboard (ESP32-S3.20), Sensors (U9.4)
IO13: Esp32-S3-Mainboard (ESP32-S3.21), Sensors (U11.4)
IO14: Esp32-S3-Mainboard (ESP32-S3.22), Sensors (U10.4)
IO35: Esp32-S3-Mainboard (ESP32-S3.28), Motortreiber (U6#2.7)
IO36: Esp32-S3-Mainboard (ESP32-S3.29), Motortreiber (U6#2.6)
IO37: Esp32-S3-Mainboard (ESP32-S3.30), Motortreiber (U6#2.2)
IO38: Esp32-S3-Mainboard (ESP32-S3.31), Motortreiber (U6#2.5)
IO39: Esp32-S3-Mainboard (ESP32-S3.32), Motortreiber (U7#2.7)
IO40: Esp32-S3-Mainboard (ESP32-S3.33), Motortreiber (U7#2.6)
IO41: Esp32-S3-Mainboard (ESP32-S3.34), Motortreiber (U7#2.2)
IO42: Esp32-S3-Mainboard (ESP32-S3.35), Motortreiber (U7#2.5)
IO45: Esp32-S3-Mainboard (ESP32-S3.26), Motortreiber (R42.2 R62.2 U6#2.3 U7#2.3)
IO48: Power_Management (LED.2), Esp32-S3-Mainboard (ESP32-S3.25)
Trigger: Esp32-S3-Mainboard (ESP32-S3.5), Sensors (6 pins)
VBatt: Power_Management (C1.2 S1.2 U1.2 U1.3), Motortreiber (16 pins)